# Altium schematic sheet dv_analog_interface_627.SchDoc
size 410 x 297 mm; DocumentNumber: 3
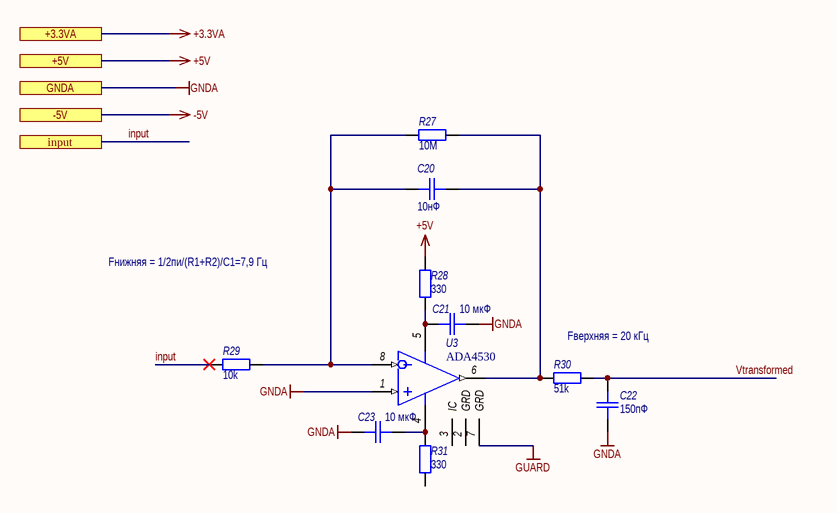
[diagram p0: dv_analog_interface_627.SchDoc]

## Parts
C20  value 10нФ  [SMD_C0805]  (hidden comment: K10-79)
C21  value 10 мкФ  [SMD_C0805]  (hidden comment: K10-79)
C22  value 150пФ  [SMD_C0805]  (hidden comment: K10-79)
C23  value 10 мкФ  [SMD_C0805]  (hidden comment: K10-79)
R27  value 10M  [SMD_0805]  (hidden comment: OSM R1-12)
R28  value 330  [SMD_0805]  (hidden comment: OSM R1-12)
R29  value 10k  [SMD_0805]  (hidden comment: OSM R1-12)
R30  value 51k  [SMD_0805]  (hidden comment: OSM R1-12)
R31  value 330  [SMD_0805]  (hidden comment: OSM R1-12)
U3  ADA4530  [SOIC-8]

## Ports
+3.3VA, +5V, -5V, GNDA, input

## Nets
+3.3VA: port +3.3VA
+5V: R28.2 ; port +5V
-5V: port -5V
GNDA: C21.1 C22.1 C23.2 U3.1(IN+) ; port GNDA
GUARD: U3.7(GRD)
input: R29.1 ; port input
Vtransformed: C22.2 R30.2
NetC20_1: C20.1 R27.1 R29.2 U3.8(IN-)
NetC20_2: C20.2 R27.2 R30.1 U3.6(OUT)
NetC21_2: C21.2 R28.1 U3.5(V+)
NetC23_1: C23.1 R31.2 U3.4(V-)

Not connected (* = marked no-connect by the designer): R31 1; U3 2(GRD) 3(IC)

## Notes on the sheet
- Fнижняя = 1/2пи/(R1+R2)/C1=7,9 Гц
- Fверхняя = 20 кГц
- Подп. и дата
- Инв. № дубл.
- Взам. инв. №
- Инв. № подл.
- Изм.
- Лист
- № докум.
- Подп.
- Дата
- Форма 2а ГОСТ 2.104-2006
- Копировал
- Формат А3

## Library data of the parts
C20-C23 = Capacitor: Назначение: SMD-конденсатор; Наименование: К10-79; Потребление, Вт: 0; Напряжение: В; Точность: %
R27-R31 = Resistor: Наименование: ОСМ Р1-12; Назначение: SMD-резистор; Потребление, Вт: 0,001; Точность: %
U3 = ADA4530: Ultra-Low Bias Current Difet OpAmp; Назначение: Операционный усилитель; Потребление, Вт: 0,005; Наименование: ADA4530